# EAGLE schematic protoshield (EAGLE 7.0.0)
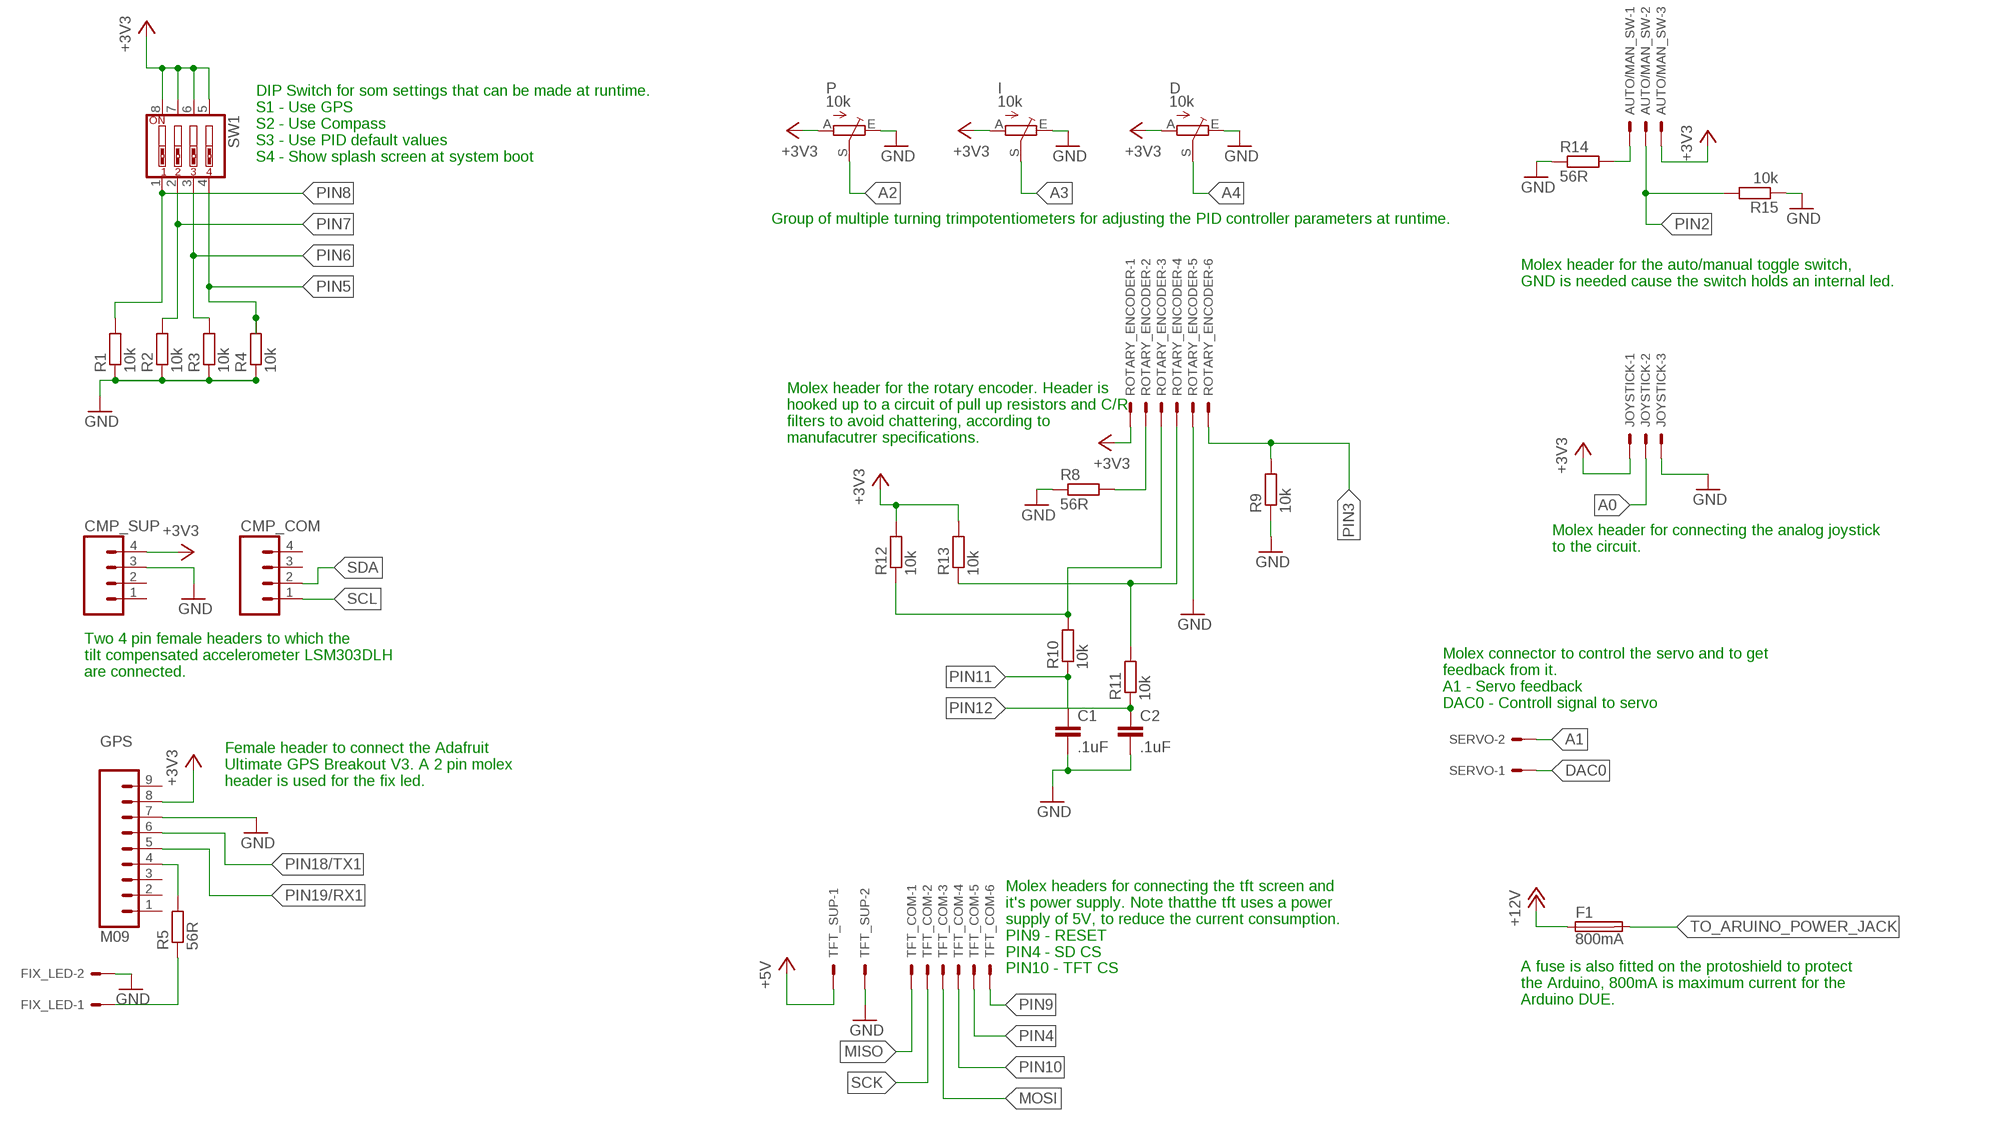
[diagram p0: schematic, sheet 1]

## Parts
AUTO/MAN_SW  KK-156-3  [KK-156-3]
C1  .1uF  C-EU025-024X044  [C025-024X044]
C2  .1uF  C-EU025-024X044  [C025-024X044]
CMP_COM  M04PTH  [1X04]
CMP_SUP  M04PTH  [1X04]
D  10k  TRIM_EU-S64W  [S64W]
F1  800mA  SH22,5  [SH22,5]
FIX_LED  KK-156-2  [KK-156-2]
GPS  M09  [1X09]
I  10k  TRIM_EU-S64W  [S64W]
JOYSTICK  KK-156-3  [KK-156-3]
P  10k  TRIM_EU-S64W  [S64W]
R1  10k  R-EU_0204/7  [0204/7]
R2  10k  R-EU_0204/7  [0204/7]
R3  10k  R-EU_0204/7  [0204/7]
R4  10k  R-EU_0204/7  [0204/7]
R5  56R  R-EU_0204/7  [0204/7]
R8  56R  R-EU_0204/7  [0204/7]
R9  10k  R-EU_0204/7  [0204/7]
R10  10k  R-EU_0204/7  [0204/7]
R11  10k  R-EU_0204/7  [0204/7]
R12  10k  R-EU_0204/7  [0204/7]
R13  10k  R-EU_0204/7  [0204/7]
R14  56R  R-EU_0204/7  [0204/7]
R15  10k  R-EU_0204/7  [0204/7]
ROTARY_ENCODER  KK-156-6  [KK-156-6]
SERVO  KK-156-2  [KK-156-2]
SW1  SW_DIP-4  [EDG-04]
TFT_COM  KK-156-6  [KK-156-6]
TFT_SUP  KK-156-2  [KK-156-2]

## Nets
+3V3: AUTO/MAN_SW.3 CMP_SUP.4 D.A GPS.8 I.A JOYSTICK.1 P.A R12.2 R13.2 ROTARY_ENCODER.1 SW1.5 SW1.6 SW1.7 SW1.8
+5V: TFT_SUP.1
+12V: F1.1
A0: JOYSTICK.2
A1: SERVO.2
A2: P.S
A3: I.S
A4: D.S
DAC0: SERVO.1
GND: C1.2 C2.2 CMP_SUP.3 D.E FIX_LED.2 GPS.7 I.E JOYSTICK.3 P.E R1.1 R2.1 R3.1 R4.1 R8.1 R9.1 R14.1 R15.1 ROTARY_ENCODER.5 TFT_SUP.2
MISO: TFT_COM.1
MOSI: TFT_COM.3
N$1: AUTO/MAN_SW.1 R14.2
N$2: R8.2 ROTARY_ENCODER.2
N$3: GPS.4 R5.2
N$4: R11.2 R13.1 ROTARY_ENCODER.4
N$5: R10.2 R12.1 ROTARY_ENCODER.3
N$6: FIX_LED.1 R5.1
PIN2: AUTO/MAN_SW.2 R15.2
PIN3: R9.2 ROTARY_ENCODER.6
PIN4: TFT_COM.5
PIN5: R4.2 SW1.4
PIN6: R3.2 SW1.3
PIN7: R2.2 SW1.2
PIN8: R1.2 SW1.1
PIN9: TFT_COM.6
PIN10: TFT_COM.4
PIN11: C1.1 R10.1
PIN12: C2.1 R11.1
PIN18/TX1: GPS.6
PIN19/RX1: GPS.5
SCK: TFT_COM.2
SCL: CMP_COM.1
SDA: CMP_COM.2
TO_ARUINO_POWER_JACK: F1.2
Unconnected: CMP_COM.3 CMP_COM.4 CMP_SUP.1 CMP_SUP.2 GPS.1 GPS.2 GPS.3 GPS.9

## Notes on the sheet
- DIP Switch for som settings that can be made at runtime.
  S1 - Use GPS
  S2 - Use Compass
  S3 - Use PID default values
  S4 - Show splash screen at system boot
- Group of multiple turning trimpotentiometers for adjusting the PID controller parameters at runtime.
- Molex header for the auto/manual toggle switch,
  GND is needed cause the switch holds an internal led.
- Molex header for the rotary encoder. Header is 
  hooked up to a circuit of pull up resistors and C/R
  filters to avoid chattering, according to 
  manufacutrer specifications.
- Molex header for connecting the analog joystick
  to the circuit.
- Two 4 pin female headers to which the
  tilt compensated accelerometer LSM303DLH
  are connected.
- Molex connector to control the servo and to get
  feedback from it.
  A1 - Servo feedback
  DAC0 - Controll signal to servo
- Female header to connect the Adafruit
  Ultimate GPS Breakout V3. A 2 pin molex
  header is used for the fix led.
- Molex headers for connecting the tft screen and
  it's power supply. Note thatthe tft uses a power
  supply of 5V, to reduce the current consumption.
  PIN9 - RESET
  PIN4 - SD CS
  PIN10 - TFT CS
- A fuse is also fitted on the protoshield to protect
  the Arduino, 800mA is maximum current for the
  Arduino DUE.

## Library data of the parts
AUTO/MAN_SW JOYSTICK = con-molex:KK-156-3: KK 156 HEADER Source: http://www.molex.com/pdm_docs/sd/026604100_sd.pdf; OC_FARNELL: unknown; OC_NEWARK: unknown
C1 C2 = rcl:C-EU: CAPACITOR, European symbol
CMP_COM CMP_SUP = SparkFun-Connectors:M04: Header 4 Standard 4-pin 0.1" header. Use with straight break away headers (SKU : PRT-00116), right angle break away headers (PRT-00553), swiss pins (PRT-00743), machine pins (PRT-00117), and female headers (PRT-00115). Molex polarized connector foot print use with SKU : PRT-08231 with associated crimp pins and housings. 1MM SMD Version SKU: PRT-10208
D I P = pot:TRIM_EU-: POTENTIOMETER
F1 = fuse:SH22,5: FUSE HOLDER grid 22,5 mm, OGN0031 8201, Schurter (Buerklin); MF: SCHURTER; MPN: 0031.8201; OC_FARNELL: 1162740; OC_NEWARK: 96F8317
FIX_LED SERVO TFT_SUP = con-molex:KK-156-2: KK 156 HEADER Source: http://www.molex.com/pdm_docs/sd/026604100_sd.pdf; OC_FARNELL: unknown; OC_NEWARK: unknown
GPS = SparkFun-Connectors:M09: Header 9 Standard 9-pin 0.1" header. Use with straight break away headers (SKU : PRT-00116), right angle break away headers (PRT-00553), swiss pins (PRT-00743), machine pins (PRT-00117), and female headers (PRT-00115).
R1-R5 R8-R15 = resistor:R-EU_: RESISTOR, European symbol
ROTARY_ENCODER TFT_COM = con-molex:KK-156-6: KK 156 HEADER Source: http://www.molex.com/pdm_docs/sd/026604100_sd.pdf; OC_FARNELL: unknown; OC_NEWARK: unknown
SW1 = special:SW_DIP-4: DIP SWITCH